# Altium schematic sheet 10_Ethernet-YT8521SC_CA.SchDoc
size 297 x 209 mm
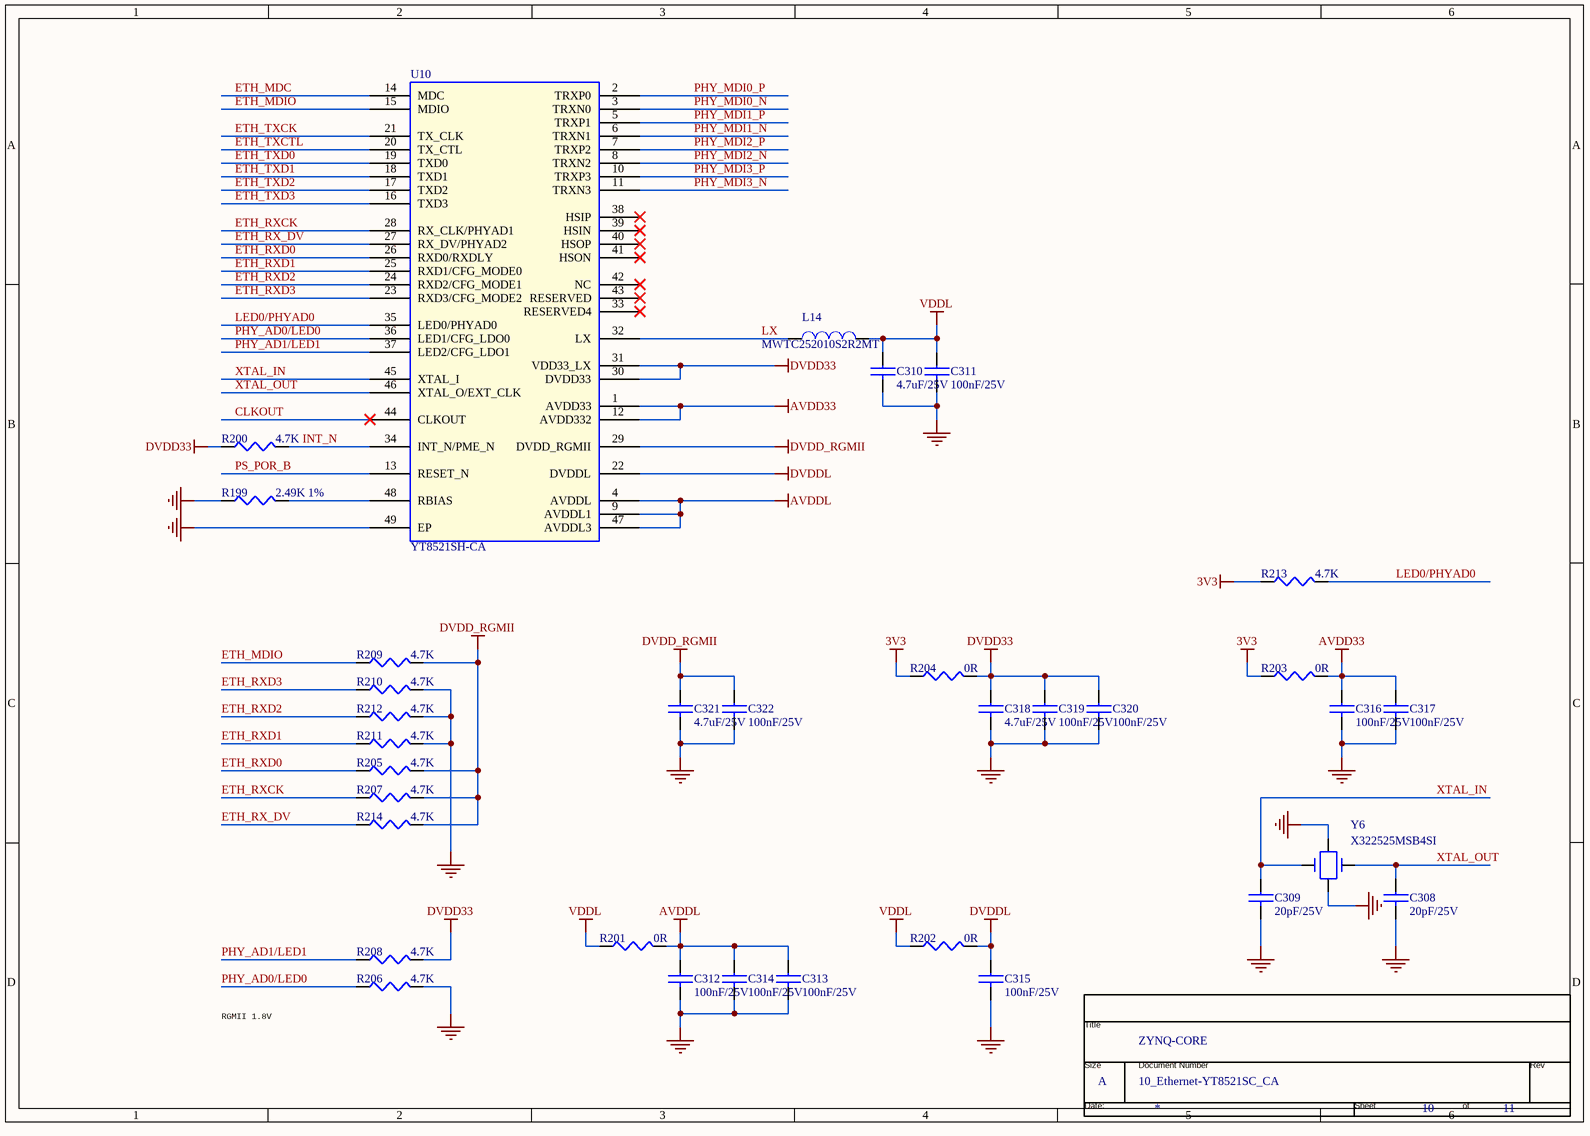
[diagram p0: 10_Ethernet-YT8521SC_CA.SchDoc]

## Parts
*  Page Count: 11  Page Number: 10  Page Size: A  Title: ZYNQ-CORE  Doc: 10_Ethernet-YT8521SC_CA  (hidden comment: TitleBlock0)  (graphical)
C308  20pF/25V  [C0402]
C309  20pF/25V  [C0402]
C310  4.7uF/25V  [C0603]
C311  100nF/25V  [C0402]
C312  100nF/25V  [C0402]
C313  100nF/25V  [C0402]
C314  100nF/25V  [C0402]
C315  100nF/25V  [C0402]
C316  100nF/25V  [C0402]
C317  100nF/25V  [C0402]
C318  4.7uF/25V  [C0603]
C319  100nF/25V  [C0402]
C320  100nF/25V  [C0402]
C321  4.7uF/25V  [C0603]
C322  100nF/25V  [C0402]
L14  MWTC252010S2R2MT  [2520]
R199  2.49K 1%  [R0402]
R200  4.7K  [R0402]
R201  0R  [R0402]
R202  0R  [R0402]
R203  0R  [R0402]
R204  0R  [R0402]
R205  4.7K  [R0402]
R206  4.7K  [R0402]
R207  4.7K  [R0402]
R208  4.7K  [R0402]
R209  4.7K  [R0402]
R210  4.7K  [R0402]
R211  4.7K  [R0402]
R212  4.7K  [R0402]
R213  4.7K  [R0402]
R214  4.7K  [R0402]
U10  YT8521SH-CA  [QFN48]
Y6  X322525MSB4SI  [3225]

## Nets
3V3: R203.1 R204.1 R213.1
AVDD33: C316.1 C317.1 R203.2 U10.1(AVDD33) U10.12(AVDD332)
AVDDL: C312.1 C313.1 C314.1 R201.2 U10.4(AVDDL) U10.9(AVDDL1) U10.47(AVDDL3)
DVDD33: C318.1 C319.1 C320.1 R200.1 R204.2 R208.2 U10.30(DVDD33) U10.31(VDD33_LX)
DVDD_RGMII: C321.1 C322.1 R205.2 R207.2 R209.2 R214.2 U10.29(DVDD_RGMII)
DVDDL: C315.1 R202.2 U10.22(DVDDL)
GND: C308.2 C309.2 C310.2 C311.2 C312.2 C313.2 C314.2 C315.2 C316.2 C317.2 C318.2 C319.2 C320.2 C321.2 C322.2 R199.1 R206.2 R210.2 R211.2 R212.2 U10.49(EP) Y6.2 Y6.4
VDDL: C310.1 C311.1 L14.2 R201.1 R202.1
CLKOUT: U10.44(CLKOUT)
ETH_MDC: U10.14(MDC)
ETH_MDIO: R209.1 U10.15(MDIO)
ETH_RX_DV: R214.1 U10.27(RX_DV/PHYAD2)
ETH_RXCK: R207.1 U10.28(RX_CLK/PHYAD1)
ETH_RXD0: R205.1 U10.26(RXD0/RXDLY)
ETH_RXD1: R211.1 U10.25(RXD1/CFG_MODE0)
ETH_RXD2: R212.1 U10.24(RXD2/CFG_MODE1)
ETH_RXD3: R210.1 U10.23(RXD3/CFG_MODE2)
ETH_TXCK: U10.21(TX_CLK)
ETH_TXCTL: U10.20(TX_CTL)
ETH_TXD0: U10.19(TXD0)
ETH_TXD1: U10.18(TXD1)
ETH_TXD2: U10.17(TXD2)
ETH_TXD3: U10.16(TXD3)
INT_N: R200.2 U10.34(INT_N/PME_N)
LED0/PHYAD0: R213.2 U10.35(LED0/PHYAD0)
LX: L14.1 U10.32(LX)
PHY_AD0/LED0: R206.1 U10.36(LED1/CFG_LDO0)
PHY_AD1/LED1: R208.1 U10.37(LED2/CFG_LDO1)
PHY_MDI0_N: U10.3(TRXN0)
PHY_MDI0_P: U10.2(TRXP0)
PHY_MDI1_N: U10.6(TRXN1)
PHY_MDI1_P: U10.5(TRXP1)
PHY_MDI2_N: U10.8(TRXN2)
PHY_MDI2_P: U10.7(TRXP2)
PHY_MDI3_N: U10.11(TRXN3)
PHY_MDI3_P: U10.10(TRXP3)
PS_POR_B: U10.13(RESET_N)
XTAL_IN: C309.1 U10.45(XTAL_I) Y6.3
XTAL_OUT: C308.1 U10.46(XTAL_O/EXT_CLK) Y6.1
NetR199_2: R199.2 U10.48(RBIAS)

Not connected (* = marked no-connect by the designer): U10 33(RESERVED4)* 38(HSIP)* 39(HSIN)* 40(HSOP)* 41(HSON)* 42(NC)* 43(RESERVED)*

## Notes on the sheet
- RGMII 1.8V
- (in symbol TitleBlock0) Title; Size; Document Number; Rev; Date:; Sheet; of

## Library data of the parts
C308-C322 = CAP NP
  C308 C309 C311-C317 C319 C320 C322: PCB Footprint: C0402
  C310 C318 C321: PCB Footprint: C0603
L14 = INDUCTOR: PCB Footprint: 2520
R199-R214 = RESISTOR_Dup1: PCB Footprint: R0402
U10 = YT8521S_1_U1_3: DifferentialPair: True; PCB Footprint: QFN48
Y6 = CRYSTAL_passive: PCB Footprint: 3225
* = TitleBlock0: Page Create Date: March  8, 1995; Page Modify Date: *